# Altium schematic sheet FrontEndEval.SchDoc
size A
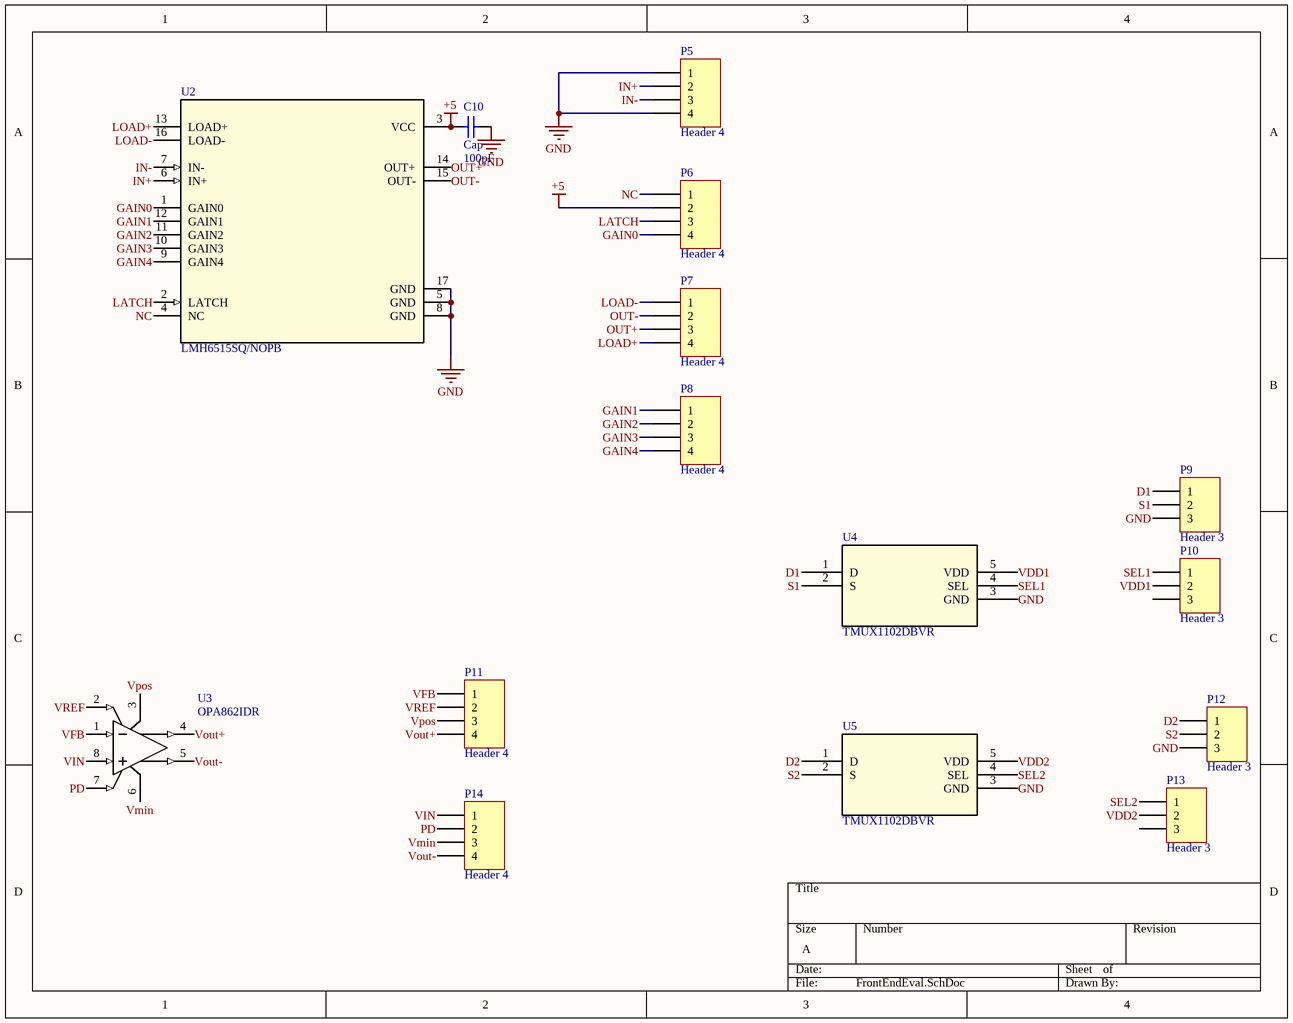
[diagram p0: FrontEndEval.SchDoc]

## Parts
C10  Cap  value 100pF  [RAD-0.3]
P5  Header 4  [HDR1X4]
P6  Header 4  [HDR1X4]
P7  Header 4  [HDR1X4]
P8  Header 4  [HDR1X4]
P9  Header 3  [HDR1X3]
P10  Header 3  [HDR1X3]
P11  Header 4  [HDR1X4]
P12  Header 3  [HDR1X3]
P13  Header 3  [HDR1X3]
P14  Header 4  [HDR1X4]
U2  LMH6515SQ/NOPB  [SQA16A]
U3  OPA862IDR  [D0008A_N]
U4  TMUX1102DBVR  [SOT-23-5_1P6X2P9_THT]
U5  TMUX1102DBVR  [SOT-23-5_1P6X2P9_THT]

## Nets
+5: C10.1 P6.2 U2.3(VCC)
GND: C10.2 P5.1 P5.4 P9.3 P12.3 U2.5(GND) U2.8(GND) U2.17(GND) U4.3(GND) U5.3(GND)
D1: P9.1 U4.1(D)
D2: P12.1 U5.1(D)
GAIN0: P6.4 U2.1(GAIN0)
GAIN1: P8.1 U2.12(GAIN1)
GAIN2: P8.2 U2.11(GAIN2)
GAIN3: P8.3 U2.10(GAIN3)
GAIN4: P8.4 U2.9(GAIN4)
IN+: P5.2 U2.6(IN+)
IN-: P5.3 U2.7(IN-)
LATCH: P6.3 U2.2(LATCH)
LOAD+: P7.4 U2.13(LOAD+)
LOAD-: P7.1 U2.16(LOAD-)
NC: P6.1 U2.4(NC)
OUT+: P7.3 U2.14(OUT+)
OUT-: P7.2 U2.15(OUT-)
PD: P14.2 U3.7(PD_N)
S1: P9.2 U4.2(S)
S2: P12.2 U5.2(S)
SEL1: P10.1 U4.4(SEL)
SEL2: P13.1 U5.4(SEL)
VDD1: P10.2 U4.5(VDD)
VDD2: P13.2 U5.5(VDD)
VFB: P11.1 U3.1(VIN-)
VIN: P14.1 U3.8(VIN+)
Vmin: P14.3 U3.6(VS-)
Vout+: P11.4 U3.4(VOUT+)
Vout-: P14.4 U3.5(VOUT-)
Vpos: P11.3 U3.3(VS+)
VREF: P11.2 U3.2(VOCM)

Not connected (* = marked no-connect by the designer): P10 3; P13 3

## Library data of the parts
C10 = Cap: Capacitor; Published: 8-Jun-2000; LatestRevisionDate: 17-Jul-2002; LatestRevisionNote: Re-released for DXP Platform.; PackageReference: RAD-0.3; Publisher: Altium Limited; PackageDescription: Radial Cap, Thru-Hole; 2 Leads; 0.3 in Pin Spacing
P5-P8 P11 P14 = Header 4: Header, 4-Pin; LatestRevisionDate: 17-Jul-2002; LatestRevisionNote: Re-released for DXP Platform.; Publisher: Altium Limited
P9 P10 P12 P13 = Header 3: Header, 3-Pin; LatestRevisionDate: 17-Jul-2002; LatestRevisionNote: Re-released for DXP Platform.; Publisher: Altium Limited
U2 = LMH6515SQ/NOPB: No Description Available; Copyright: Copyright (C) 2018 Accelerated Designs. All rights reserved; RefDes: RefDes; Type: DEV
U3 = OPA862IDR: No Description Available; Manufacturer: Texas Instruments; PartNumber: OPA862IDR; RefDes: RefDes; Type: DEV; Value: Value; Copyright: Copyright (C) 2018 Accelerated Designs. All rights reserved
U4 U5 = TMUX1102DBVR: No Description Available; Vendor: Texas Instruments; SourceLibrary: Add_to_database_2020-10-19; Datasheet: https://www.ti.com/lit/ds/symlink/tmux1101.pdf?HQS=TI-null-null-digikeymode-df-pf-null-wwe&ts=1603128596910; Copyright: Copyright (C) 2018 Accelerated Designs. All rights reserved; Manufacturer_Part_Number: TMUX1102DBVR; RefDes: RefDes; Type: DEV